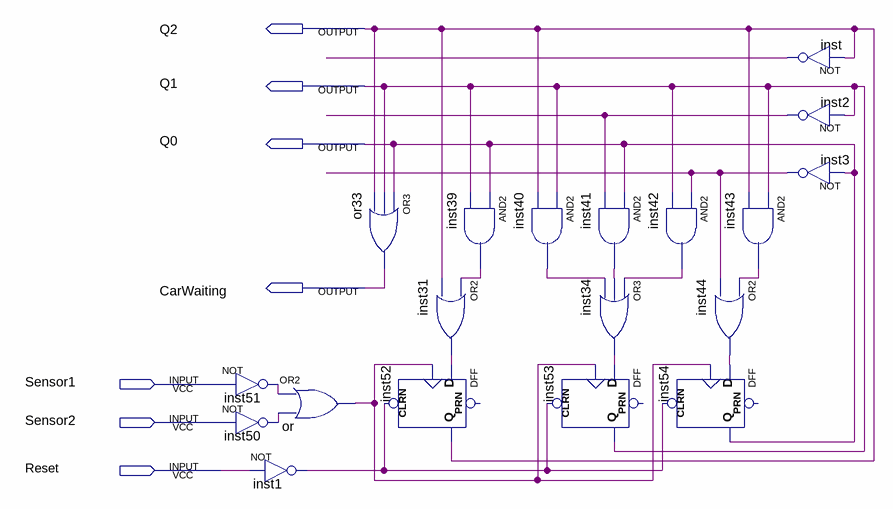
[diagram p0: schematic sheet]
// Quartus schematic carCounter.bdf as structural Verilog: 19 symbols, 7 pins
module carCounter (
  input  Sensor1,
  input  Sensor2,
  input  Reset,
  output Q2,
  output Q1,
  output Q0,
  output CarWaiting
);

  wire inst1_out, inst2_out, inst3_out, inst31_out, inst34_out, inst39_out, inst40_out, inst41_out,
       inst42_out, inst43_out, inst44_out, inst50_out, inst51_out, inst_out, or_out;

  not inst51 (inst51_out, Sensor1);
  not inst50 (inst50_out, Sensor2);
  or \or  (or_out, inst51_out, inst50_out);
  not inst1 (inst1_out, Reset);
  or or33 (CarWaiting, Q0, Q1, Q2);
  DFF inst52 (.CLRN(inst1_out), .CLK(or_out), .D(inst31_out), .Q(Q2));  // open: PRN
  and inst39 (inst39_out, Q0, Q1);
  or inst31 (inst31_out, inst39_out, Q2);
  and inst40 (inst40_out, Q1, Q2);
  DFF inst53 (.CLRN(inst1_out), .CLK(or_out), .D(inst34_out), .Q(Q1));  // open: PRN
  and inst41 (inst41_out, Q0, inst2_out);
  or inst34 (inst34_out, inst42_out, inst41_out, inst40_out);
  and inst42 (inst42_out, inst3_out, Q1);
  or inst44 (inst44_out, inst43_out, inst3_out);
  DFF inst54 (.CLRN(inst1_out), .CLK(or_out), .D(inst44_out), .Q(Q0));  // open: PRN
  and inst43 (inst43_out, Q1, Q2);
  not inst (inst_out, Q2);
  not inst2 (inst2_out, Q1);
  not inst3 (inst3_out, Q0);
endmodule
